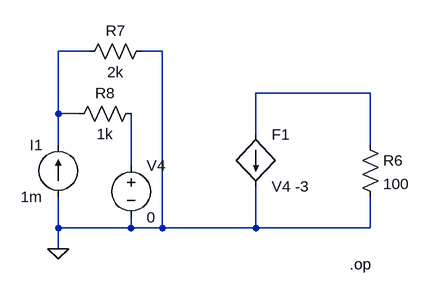
[diagram p0: schematic Exp 1 0.2 Linear Dependent Sources.asc]
Exp 1 0.2 Linear Dependent Sources.asc, the LTspice schematic file:
Version 4
SHEET 1 880 720
WIRE 240 224 192 224
WIRE 352 224 320 224
WIRE 672 288 496 288
WIRE 192 320 192 224
WIRE 224 320 192 320
WIRE 496 352 496 288
WIRE 192 368 192 320
WIRE 672 368 672 288
WIRE 304 400 304 320
WIRE 192 496 192 448
WIRE 304 496 304 480
WIRE 304 496 192 496
WIRE 352 496 352 224
WIRE 352 496 304 496
WIRE 496 496 496 432
WIRE 496 496 352 496
WIRE 672 496 672 448
WIRE 672 496 496 496
WIRE 192 528 192 496
FLAG 192 528 0
DATAFLAG 576 288 "$"
SYMBOL res 320 304 R90
WINDOW 0 0 56 VBottom 2
WINDOW 3 32 56 VTop 2
SYMATTR InstName R8
SYMATTR Value 1k
SYMBOL res 336 208 R90
WINDOW 0 0 56 VBottom 2
WINDOW 3 32 56 VTop 2
SYMATTR InstName R7
SYMATTR Value 2k
SYMBOL res 656 352 R0
SYMATTR InstName R6
SYMATTR Value 100
SYMBOL current 192 448 R180
WINDOW 0 24 80 Left 2
WINDOW 3 24 0 Left 2
SYMATTR InstName I1
SYMATTR Value 1m
SYMBOL f 496 352 R0
SYMATTR InstName F1
SYMATTR Value V4 -3
SYMBOL voltage 304 384 R0
SYMATTR InstName V4
SYMATTR Value 0
TEXT 640 552 Left 2 !.op

The netlist it stands for:
* Exp 1 0.2 Linear Dependent Sources.asc
R8 N003 N001 1k
R7 0 N001 2k
R6 N002 0 100
I1 0 N001 1m
F1 N002 0 V4 -3
V4 N003 0 0
.op
.backanno
.end